# Altium project xbw.PrjPCB
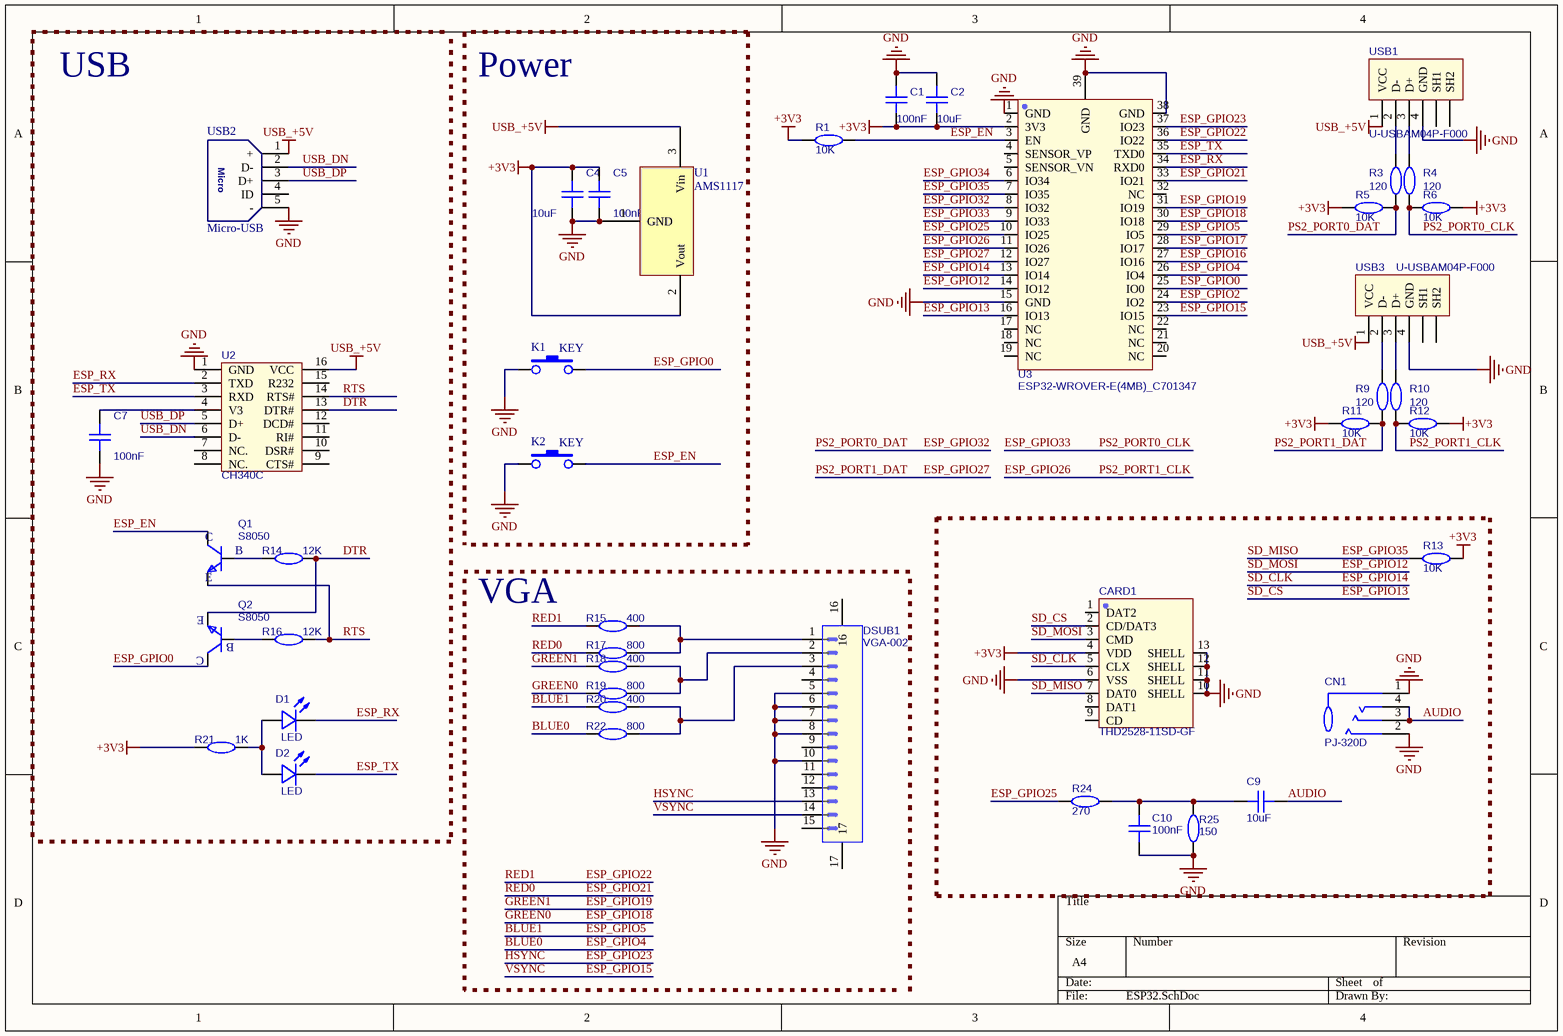
[diagram p0: ESP32.SchDoc]
1 sheet, 43 parts. Net scope: global (net labels, ports and power ports of the same name join across sheets).
Board files: xbw - surface.PcbDoc, xbw.PcbDoc

## Sheet ESP32.SchDoc
size A4

### Parts
C1  100nF  [0805C]
C2  10uF  [0805C]
C4  10uF  [0805C]
C5  100nF  [0805C]
C7  100nF  [0805C]
C9  10uF  [0805C]
C10  100nF  [0805C]
CARD1  THD2528-11SD-GF  [Micro SD]
CN1  PJ-320D  [AUDIO-SMD_PJ-320D]
D1  LED  [LED-0603]
D2  LED  [LED-0603]
DSUB1  VGA-002  [VGA15/F/90]
K1  KEY  [SW-SMD_L3.9-W2.9-P4.15-LS5.0]
K2  KEY  [SW-SMD_L3.9-W2.9-P4.15-LS5.0]
Q1  S8050  [SOT-23_L2.9-W1.3-P0.95-LS2.4-BR]
Q2  S8050  [SOT-23_L2.9-W1.3-P0.95-LS2.4-BR]
R1  10K  [0805R]
R3  120  [0805R]
R4  120  [0805R]
R5  10K  [0805R]
R6  10K  [0805R]
R9  120  [0805R]
R10  120  [0805R]
R11  10K  [0805R]
R12  10K  [0805R]
R13  10K  [0805R]
R14  12K  [0805R]
R15  400  [0805R]
R16  12K  [0805R]
R17  800  [0805R]
R18  400  [0805R]
R19  800  [0805R]
R20  400  [0805R]
R21  1K  [0805R]
R22  800  [0805R]
R24  270  [0805R]
R25  150  [0805R]
U1  AMS1117  [SOT223]
U2  CH340C  [SOP16]
U3  ESP32-WROVER-E(4MB)_C701347  [XCVR_ESP32-WROVER-I]
USB1  U-USBAM04P-F000  [USB-A/S_B]
USB2  Micro-USB  [USB-MICRO_A]
USB3  U-USBAM04P-F000  [USB-A/S_B]

### Nets
+3V3: C1.2 C2.2 C4.2 C5.2 CARD1.4(VDD) R1.1 R5.2 R6.1 R11.2 R12.1 R13.1 R21.2 U1.2(Vout) U3.2(3V3)
GND: C1.1 C2.1 C4.1 C5.1 C7.1 C10.1 CARD1.6(VSS) CARD1.10(SHELL) CARD1.11(SHELL) CARD1.12(SHELL) CARD1.13(SHELL) CN1.1 CN1.2 DSUB1.5 DSUB1.6 DSUB1.7 DSUB1.8 DSUB1.10 K1.1 K2.1 R25.2 U1.1(GND) U2.1(GND) U3.1(GND) U3.15(GND) U3.38(GND) U3.39(GND) USB1.4(GND) USB2.5(-) USB3.4(GND)
USB_+5V: U1.3(Vin) U2.16(VCC) USB1.1(VCC) USB2.1(+) USB3.1(VCC)
AUDIO: C9.1 CN1.3 CN1.4
BLUE0: R22.2 U3.26(IO4)  [also labelled ESP_GPIO4]
BLUE1: R20.2 U3.29(IO5)  [also labelled ESP_GPIO5]
DTR: Q2.2(E) R14.1 U2.13(DTR#)
ESP_EN: K2.3 Q1.3(C) R1.2 U3.3(EN)
ESP_GPIO0: K1.3 Q2.3(C) U3.25(IO0)
ESP_GPIO2: U3.24(IO2)
ESP_GPIO12: CARD1.3(CMD) U3.14(IO12)  [also labelled SD_MOSI]
ESP_GPIO13: CARD1.2(CD/DAT3) U3.16(IO13)  [also labelled SD_CS]
ESP_GPIO14: CARD1.5(CLX) U3.13(IO14)  [also labelled SD_CLK]
ESP_GPIO15: DSUB1.14 U3.23(IO15)  [also labelled VSYNC]
ESP_GPIO16: U3.27(IO16)
ESP_GPIO17: U3.28(IO17)
ESP_GPIO18: R19.2 U3.30(IO18)  [also labelled GREEN0]
ESP_GPIO19: R18.2 U3.31(IO19)  [also labelled GREEN1]
ESP_GPIO21: R17.2 U3.33(IO21)  [also labelled RED0]
ESP_GPIO22: R15.2 U3.36(IO22)  [also labelled RED1]
ESP_GPIO23: DSUB1.13 U3.37(IO23)  [also labelled HSYNC]
ESP_GPIO25: R24.2 U3.10(IO25)
ESP_GPIO26: R10.2 R12.2 U3.11(IO26)  [also labelled PS2_PORT1_CLK]
ESP_GPIO27: R9.2 R11.1 U3.12(IO27)  [also labelled PS2_PORT1_DAT]
ESP_GPIO32: R3.2 R5.1 U3.8(IO32)  [also labelled PS2_PORT0_DAT]
ESP_GPIO33: R4.2 R6.2 U3.9(IO33)  [also labelled PS2_PORT0_CLK]
ESP_GPIO34: U3.6(IO34)
ESP_GPIO35: CARD1.7(DAT0) R13.2 U3.7(IO35)  [also labelled SD_MISO]
ESP_RX: D1.2(K) U2.2(TXD) U3.34(RXD0)
ESP_TX: D2.2(K) U2.3(RXD) U3.35(TXD0)
RTS: Q1.2(E) R16.1 U2.14(RTS#)
USB_DN: U2.6(D-) USB2.2(D-)
USB_DP: U2.5(D+) USB2.3(D+)
NetC7_2: C7.2 U2.4(V3)
NetC9_2: C9.2 C10.2 R24.1 R25.1
NetD1_1: D1.1(A) D2.1(A) R21.1
NetDSUB1_1: DSUB1.1 R15.1 R17.1
NetDSUB1_2: DSUB1.2 R18.1 R19.1
NetDSUB1_3: DSUB1.3 R20.1 R22.1
NetQ1_1: Q1.1(B) R14.2
NetQ2_1: Q2.1(B) R16.2
NetR3_1: R3.1 USB1.2(D-)
NetR4_1: R4.1 USB1.3(D+)
NetR9_1: R9.1 USB3.2(D-)
NetR10_1: R10.1 USB3.3(D+)

Not connected (* = marked no-connect by the designer): CARD1 1(DAT2) 8(DAT1) 9(CD); DSUB1 4 9 11 12 15 16 17; U2 7(NC.) 8(NC.) 9(CTS#) 10(DSR#) 11(RI#) 12(DCD#) 15(R232); U3 4(SENSOR_VP) 5(SENSOR_VN) 17(NC) 18(NC) 19(NC) 20(NC) 21(NC) 22(NC) 32(NC); USB1 SH1 SH2; USB2 4(ID); USB3 SH1 SH2

### Notes on the sheet
- USB
- Power
- VGA
- (in symbol Micro-USB) Micro

### Library data of the parts
C1 C2 C4 C5 C7 C9 C10 = CAP_0603: BOM_Manufacturer: YAGEO; BOM_Manufacturer Part: CC0603GRNPO9BN200; nameAlias: Capacitance; Contributor: LCSC; BOM_Supplier: LCSC; BOM_Supplier Part: C325469; spicePre: C; spiceSymbolName: CC0603GRNPO9BN200
CARD1 = THD2528-11SD-GF: BOM_Manufacturer: THD; Contributor: LCSC; BOM_Supplier: LCSC; BOM_Supplier Part: C283232; BOM_Manufacturer Part: THD2528-11SD-GF; BOM_JLCPCB Part Class: Extended Part; spicePre: C; spiceSymbolName: THD2528-11SD-GF
CN1 = PJ-320D: BOM_Manufacturer: SHOU HAN; Contributor: LCSC; BOM_Supplier: LCSC; BOM_Supplier Part: C431535; BOM_Manufacturer Part: PJ-320D; BOM_JLCPCB Part Class: Extended Part; spicePre: C; spiceSymbolName: PJ-320D
D1 D2 = LED-Y: nameAlias: Model; BOM_Manufacturer Part: ?; spicePre: D; spiceSymbolName: LED
DSUB1 = VGA-002: BOM_Manufacturer: BOOMELE; BOM_Supplier: LCSC; BOM_Manufacturer Part: VGA-002; BOM_Supplier Part: C138387; BOM_JLCPCB Part Class: Extended Part; spicePre: D; spiceSymbolName: VGA-002
Q1 Q2 = S8050: BOM_Manufacturer: GreenPower; Contributor: LCSC; BOM_Supplier: LCSC; BOM_Supplier Part: C414195; BOM_Manufacturer Part: S8050; spicePre: Q; spiceSymbolName: S8050_C414195
R1 R3-R6 R9-R22 R24 R25 = RES_0603: BOM_Manufacturer: LIZ; BOM_Manufacturer Part: CR0603JA0301G; nameAlias: Resistance (Ohms); BOM_Supplier: LCSC; BOM_Supplier Part: C101323; spicePre: R; spiceSymbolName: CR0603JA0301G
U1 = AMS1117: 三端稳压芯片
U2 = CH340C: BOM_Manufacturer: WCH; BOM_Supplier: LCSC; BOM_Manufacturer Part: CH340C; BOM_Supplier Part: C84681; BOM_JLCPCB Part Class: Extended Part; spicePre: U; spiceSymbolName: CH340C
U3 = ESP32-WROVER-E(4MB)_C701347: BOM_Manufacturer: Espressif Systems; Contributor: LCSC; BOM_Supplier: LCSC; BOM_Supplier Part: C701347; BOM_Manufacturer Part: ESP32-WROVER-E(4MB); BOM_JLCPCB Part Class: Extended Part; spicePre: U; spiceSymbolName: ESP32-WROVER-E(4MB)_C701347
USB1 USB3 = U-USBAM04P-F000: BOM_Manufacturer: Shenzhen Cankemeng; Contributor: LCSC; BOM_Supplier: LCSC; BOM_Supplier Part: C386738; BOM_Manufacturer Part: U-USBAM04P-F000; BOM_JLCPCB Part Class: Extended Part; spicePre: U; spiceSymbolName: U-USBAM04P-F000